# EAGLE design dosimeter (EAGLE 6.1)
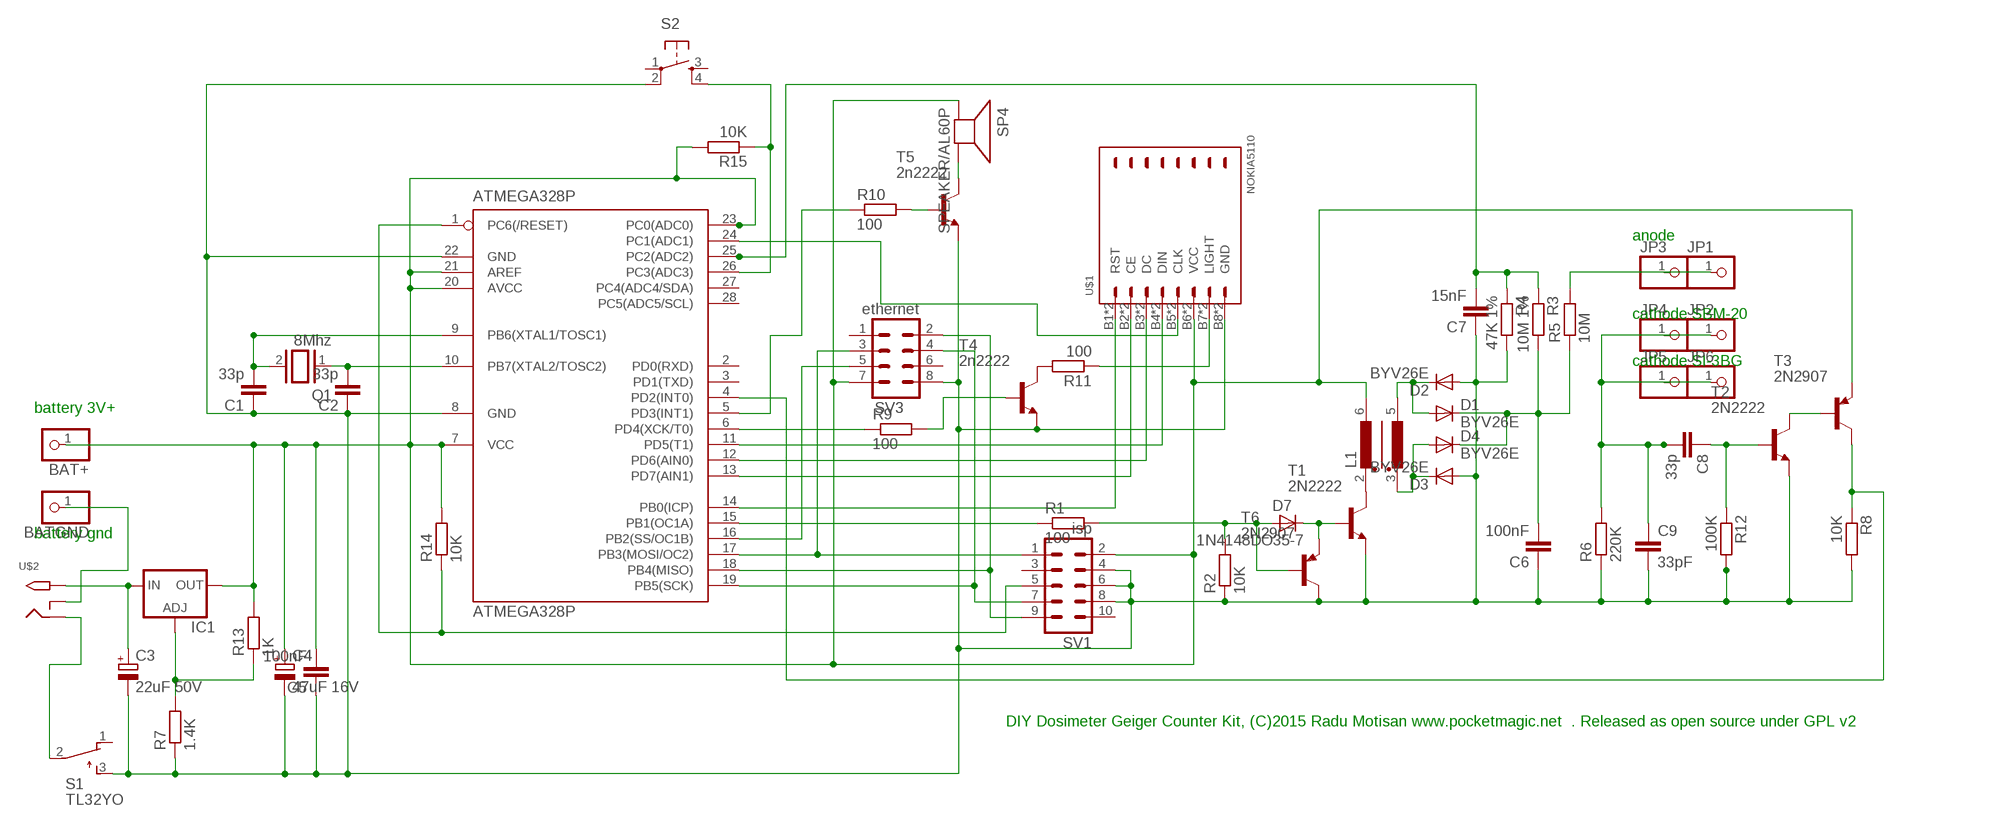
[diagram p0: schematic, sheet 1]

## Parts
ATMEGA328P  ATMEGA328P  MEGA8-P  [DIL28-3]
BAT+  PINHD-1X1  [1X01]
BATGND  PINHD-1X1  [1X01]
C1  33p  C2.5/2  [C2.5-2]
C2  33p  C2.5/2  [C2.5-2]
C3  22uF 50V  CPOL-EUE2-5  [E2-5]
C4  47uF 16V  CPOL-EUE2-5  [E2-5]
C5  100nF  C2.5/2  [C2.5-2]
C6  100nF  C5/3  [C5B3]
C7  15nF  C2.5/2  [C2.5-2]
C8  33p  C2.5/2  [C2.5-2]
C9  33pF  C2.5/2  [C2.5-2]
D1  BYV26E  1N40047.5  [D-7.5]
D2  BYV26E  1N40047.5  [D-7.5]
D3  BYV26E  1N40047.5  [D-7.5]
D4  BYV26E  1N40047.5  [D-7.5]
D7  1N4148DO35-7  [DO35-7]
IC1  LM317TL  [317TL]
JP1  PINHD-1X1  [1X01]
JP2  PINHD-1X1  [1X01]
JP3  PINHD-1X1  [1X01]
JP4  PINHD-1X1  [1X01]
JP5  PINHD-1X1  [1X01]
JP6  PINHD-1X1  [1X01]
L1  RM6-2  [RM5-4]
Q1  8Mhz  XTAL/S  [QS]
R1  100  R-EU_0204/7  [0204/7]
R2  10K  R-EU_0204/7  [0204/7]
R3  10M 1%  R-EU_0204/7  [0204/7]
R4  47K 1%  R-EU_0204/7  [0204/7]
R5  10M  R-EU_0204/7  [0204/7]
R6  220K  R-EU_0204/7  [0204/7]
R7  1.4K  R-EU_0204/7  [0204/7]
R8  10K  R-EU_0204/7  [0204/7]
R9  100  R-EU_0204/7  [0204/7]
R10  100  R-EU_0204/7  [0204/7]
R11  100  R-EU_0204/7  [0204/7]
R12  100K  R-EU_0204/7  [0204/7]
R13  1K  R-EU_0204/7  [0204/7]
R14  10K  R-EU_0204/7  [0204/7]
R15  10K  R-EU_0204/7  [0204/7]
S1  TL32YO  [TL3XYO]
S2  TAC_SWITCHPTH  [TACTILE-PTH]
SP4  SPEAKER/AL60P  [AL60P]
SV1  isp  MA05-2  [MA05-2]
SV3  ethernet  MA04-2  [MA04-2]
T1  2N2222  [TO92-EBC-OVAL]
T2  2N2222  [TO92-EBC-OVAL]
T3  2N2907  [TO92-EBC-OVAL]
T4  2n2222  2N2222-NPN-TO92-EBC  [TO92-EBC]
T5  2n2222  2N2222-NPN-TO92-EBC  [TO92-EBC]
T6  2N2907  [TO92-EBC-OVAL]
U$1  NOKIA5110  [NOKIA5110]
U$2  2.1MMJACKTHM  [PJ-102A]

## Nets
N$1: ATMEGA328P.9(PB6(XTAL1/TOSC1)) C1.2 Q1.2
N$2: ATMEGA328P.10(PB7(XTAL2/TOSC2)) C2.2 Q1.1
N$3: R11.2 T4.C
N$4: ATMEGA328P.17(PB3(MOSI/OC2)) SV1.1 SV3.3
N$5: ATMEGA328P.16(PB2(SS/OC1B)) SV3.5
N$6: ATMEGA328P.18(PB4(MISO)) SV1.9 SV3.2
N$7: R9.2 T4.B
N$8: ATMEGA328P.19(PB5(SCK)) SV1.7 SV3.4
N$9: R11.1 U$1.B7(LIGHT) U$1.T7(LIGHT)
N$11: ATMEGA328P.1(PC6(/RESET)) R14.1 SV1.5
N$12: ATMEGA328P.8(GND) ATMEGA328P.22(GND) C1.1 C2.1 C3.- C4.- C5.1 C6.1 C7.1 C9.2 D2.A D3.A R2.1 R4.2 R6.1 R7.1 R8.2 R12.2 S1.3(S) S2.2 SV1.4 SV1.6 SV1.8 SV3.8 T1.E T2.E T4.E T5.E T6.C U$1.B8(GND) U$1.T8(GND)
N$13: ATMEGA328P.24(PC1(ADC1)) U$1.B5(CLK) U$1.T5(CLK)
N$14: ATMEGA328P.26(PC3(ADC3)) R15.1 S2.4
N$15: S1.2(P) U$2.RING
N$18: JP1.1 JP3.1 R5.2
N$20: BATGND.1 U$2.RING_SW
N$21: ATMEGA328P.11(PD5(T1)) U$1.B4(DIN) U$1.T4(DIN)
N$22: ATMEGA328P.12(PD6(AIN0)) U$1.B3(DC) U$1.T3(DC)
N$23: ATMEGA328P.13(PD7(AIN1)) U$1.B2(CE) U$1.T2(CE)
N$24: ATMEGA328P.14(PB0(ICP)) U$1.B1(RST) U$1.T1(RST)
N$25: ATMEGA328P.7(VCC) ATMEGA328P.20(AVCC) ATMEGA328P.21(AREF) ATMEGA328P.23(PC0(ADC0)) BAT+.1 C4.+ C5.2 IC1.2(OUT) L1.6(W1E) R13.2 R14.2 R15.2 SP4.1(+) SV1.2 SV3.7 T3.E U$1.B6(VCC) U$1.T6(VCC)
N$26: ATMEGA328P.15(PB1(OC1A)) R1.1
N$27: D7.A R1.2 R2.2 T6.B
N$28: C3.+ IC1.3(IN) U$2.TIP
N$31: L1.2(W1A) T1.C
N$32: D3.C D4.A L1.3(W2A)
N$33: D1.A D2.C L1.5(W2E)
N$34: ATMEGA328P.6(PD4(XCK/T0)) R9.1
N$35: C6.2 D1.C D4.C R3.2 R5.1
N$40: SP4.2(-) T5.C
N$41: R10.2 T5.B
N$42: ATMEGA328P.5(PD3(INT1)) R10.1
N$48: IC1.1(ADJ) R7.2 R13.1
N$52: C8.2 C9.1 JP2.1 JP4.1 JP5.1 JP6.1 R6.2
N$54: ATMEGA328P.25(PC2(ADC2)) C7.2 R3.1 R4.1
N$56: C8.1 R12.1 T2.B
N$59: T2.C T3.B
N$60: ATMEGA328P.4(PD2(INT0)) R8.1 T3.C
N$74: D7.C T1.B T6.E
Unconnected: ATMEGA328P.2(PD0(RXD)) ATMEGA328P.3(PD1(TXD)) ATMEGA328P.27(PC4(ADC4/SDA)) ATMEGA328P.28(PC5(ADC5/SCL)) S1.1(O) S2.1 S2.3 SV1.3 SV1.10 SV3.1 SV3.6

## Notes on the sheet
- anode
- cathode SBM-20
- cathode SI-3BG
- battery 3V+
- battery gnd
- DIY Dosimeter Geiger Counter Kit, (C)2015 Radu Motisan www.pocketmagic.net  . Released as open source under GPL v2

## Library data of the parts
ATMEGA328P = atmel:MEGA8-P: MICROCONTROLLER 8 Kbytes FLASH, 1 kbytes SRAM, 512 bytes EEPROM, USART, 4-channel 10 bit ADC, 2-channel 8 bit ADC Pin compatible with Atmega48, ATMega88, ATMega168 Source: avr.lbr; OC_FARNELL: unknown; OC_NEWARK: unknown
BAT+ BATGND JP1-JP6 = adafruit:PINHD-1X1: Pin header 1x1 for 0.1" spacing With round pins
C1 C2 C5-C9 = capacitor-wima:C: CAPACITOR naming: grid - package width
C3 C4 = resistor:CPOL-EU: POLARIZED CAPACITOR, European symbol
D1-D4 = diode:1N4004: DIODE general purpose rectifier, 1 A
D7 = Diode2:1N4148: DIODE high speed (Philips)
IC1 = v-reg:LM317TL: VOLTAGE REGULATOR
L1 = trafo-siemens:RM6-2: TRANSFORMER; OC_FARNELL: unknown; OC_NEWARK: unknown
Q1 = special:XTAL/S: CRYSTAL
R1-R15 = rcl:R-EU_: RESISTOR, European symbol
S1 = switch:TL32YO: TINY SWITCH ON - MOM Source: http://www2.produktinfo.conrad.com/datenblaetter/700000-724999/705152-da-01-de-Subminiaturschalter_TL_36YO.pdf
S2 = sparkfun-electromechanical:TAC_SWITCH: Momentary Switch Button commonly used for reset or general input. Spark Fun Electronics SKU : COM-00097 SMT- SWCH-08247
SP4 = adafruit:SPEAKER: SPEAKER Source: Buerklin Added PS12 (for part # PS1240 piezo) http://www.ladyada.net/library/pcb/eaglelibrary.html
SV1 = con-lstb:MA05-2: PIN HEADER; OC_FARNELL: unknown; OC_NEWARK: unknown
SV3 = con-lstb:MA04-2: PIN HEADER; OC_FARNELL: unknown; OC_NEWARK: unknown
T1 T2 = adafruit:2N2222: NPN TRANSISTOR Big oval pads
T3 T6 = adafruit:2N2907*: PNP Transistor Big Oval pads
T4 T5 = transistor-neu-to92:*-NPN-: NPN Transistror
U$1 = NOKIA5110_OK:NOKIA5110
U$2 = adafruit:2.1MMJACK: 2.1mm x 5.5mm THM DC jack with internal switch. Digikey part #PJ-102A, 4UCON part #05537 2.1mm x 5.5mm SMT DC jack with internal switch. Digikey part #PJ-002A-SMT, 4UCON part #03267 By microbuilder.eu & adafruit.com

## Board
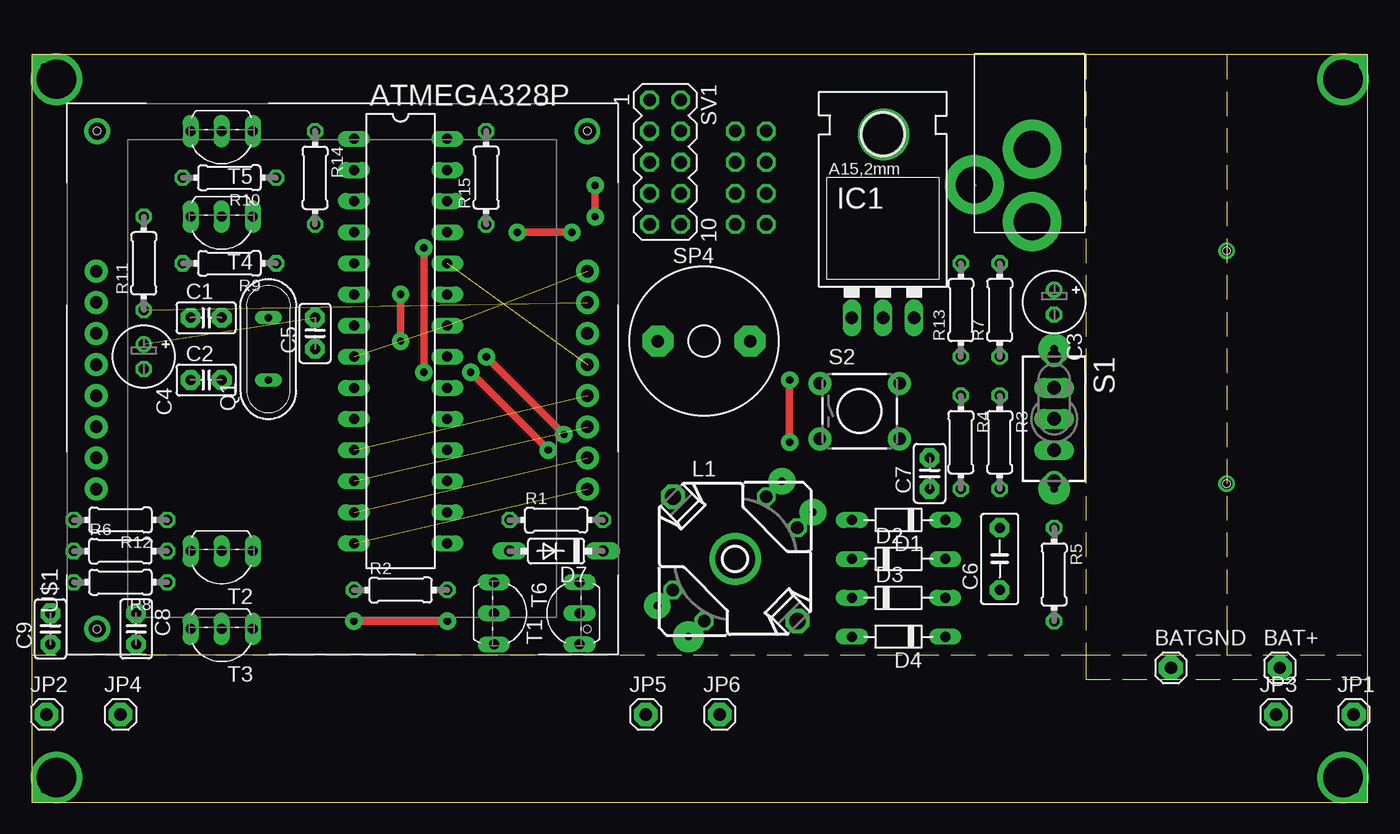
[diagram p1: board, top side]
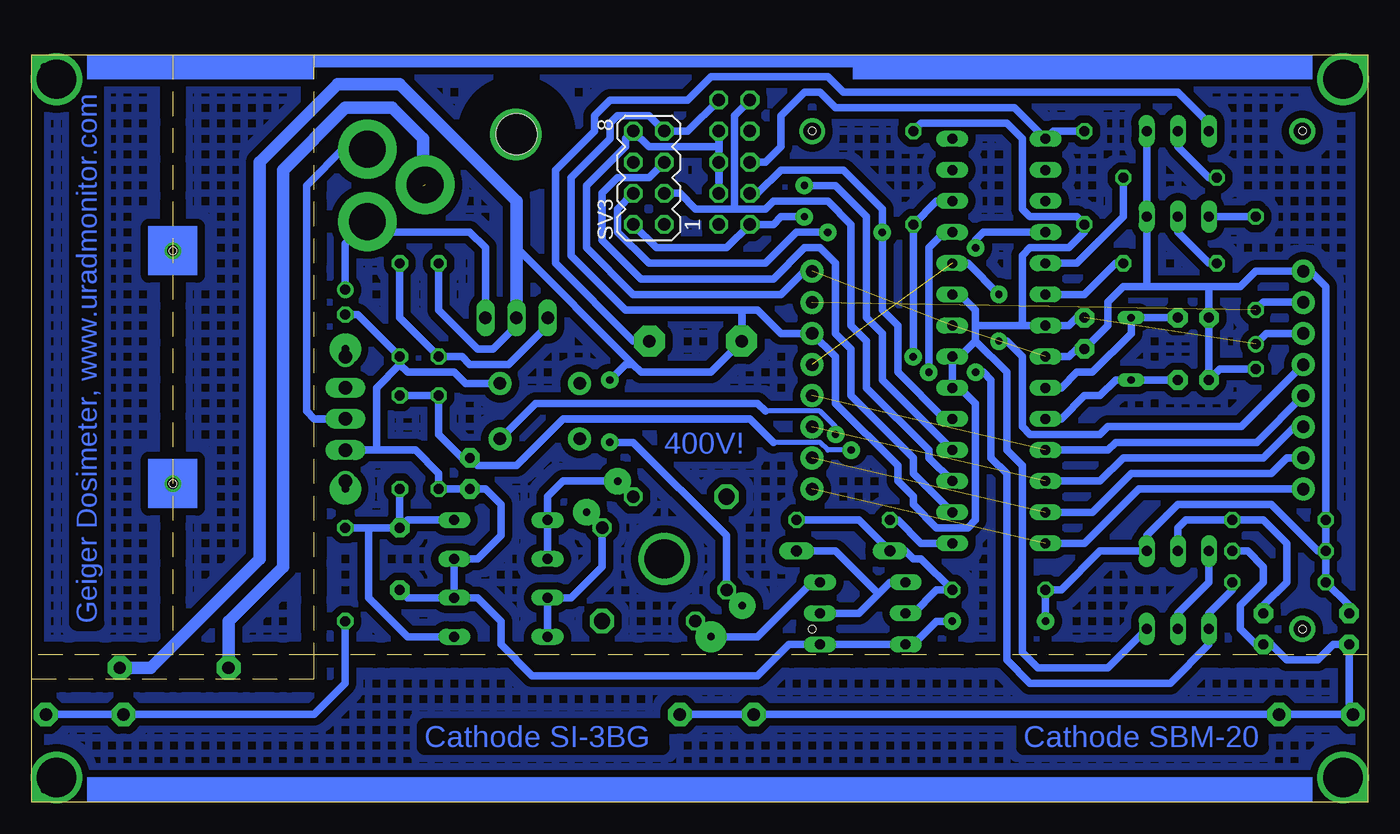
[diagram p2: board, bottom side, seen from below]

Size 109 x 61 mm. Coordinates in mm from the lower left corner, seen from the top.
Outline: 109,10 109,0 0,0 0,12
Outline: 109,10 109,12
Outline: 109,12 109,61 97.5,61
Outline: 97.5,61 86,61
Outline: 86,61 0,61 0,12
Outline: 0,12 86,12
Outline: 86,12 97.5,12
Outline: 97.5,12 109,12
Outline: 86,61 86,12
Outline: 97.5,61 97.5,12
Outline: 86,12 86,10 109,10
Outline: 109,10 109,12
Copper layers (1*16): Top 0.035mm / dielectric 1.5mm / Bottom 0.035mm
Design rules: minimum track width 10mil, minimum drill 24mil, track to track 8mil, track to pad 8mil, pad to pad 8mil, via to via 8mil, smd to smd 8mil, copper to edge 40mil, drill to drill 8mil, minimum pad ring 10mil, minimum via ring 8mil, stop-mask expansion 4mil, vias tented up to drill 0mil, thermal gap 10mil
Holes 0.6 mm at 97.5,45 97.5,26

### Footprints (pad centres in the part's own frame; a part is rotated, then mirrored left to right if it is on the bottom)
DIL28-3 = drill 0.813 long: 1 -16.51,-3.81; 2 -13.97,-3.81; 3 -11.43,-3.81; 4 -8.89,-3.81; 5 -6.35,-3.81; 6 -3.81,-3.81; 7 -1.27,-3.81; 8 1.27,-3.81; 9 3.81,-3.81; 10 6.35,-3.81; 11 8.89,-3.81; 12 11.43,-3.81; 13 13.97,-3.81; 14 16.51,-3.81; 15 16.51,3.81; 16 13.97,3.81; 17 11.43,3.81; 18 8.89,3.81; 19 6.35,3.81; 20 3.81,3.81; 21 1.27,3.81; 22 -1.27,3.81; 23 -3.81,3.81; 24 -6.35,3.81; 25 -8.89,3.81; 26 -11.43,3.81; 27 -13.97,3.81; 28 -16.51,3.81
1X01 = drill 1.016 pad 1.93 octagon: 1 0,0
C2.5-2 = drill 0.813 pad 1.6 octagon: 1 -1.27,0; 2 1.27,0
E2-5 = drill 0.813 pad 1.27: + -1.016,0 | drill 0.813 pad 1.27 octagon: - 1.016,0
C5B3 = drill 0.813 pad 1.6 octagon: 1 -2.54,0; 2 2.54,0
D-7.5 = drill 0.813 long: A 3.81,0; C -3.81,0
DO35-7 = drill 0.9 long: A 3.81,0; C -3.81,0
317TL = drill 1.016 long: 1 -2.54,-3.81; 2 0,-3.81; 3 2.54,-3.81 | hole 3.302: 0,11.176
RM5-4 = drill 1.016 octagon: 2 5.08,-2.54; 3 -2.54,5.08; 5 -5.08,2.54; 6 2.54,-5.08 | drill 1.321 octagon: M -5.08,-5.08; M1 5.08,5.08
QS = drill 0.61 long: 1 -2.54,0; 2 2.54,0
0204/7 = drill 0.813 octagon: 1 -3.81,0; 2 3.81,0
TL3XYO = drill 1.1 pad 1.422 long: 1 -2.54,0; 2 0,0; 3 2.54,0 | drill 1.1 pad 1.676: M1 -5.08,0; M2 5.08,0
TACTILE-PTH = drill 1.016 pad 1.88: 1 -3.251,2.261; 2 3.251,2.261; 3 -3.251,-2.261; 4 3.251,-2.261
AL60P = drill 1.016 pad 2.54 octagon: 1 -3.759,0; 2 3.759,0
MA05-2 = drill 1.016 octagon: 1 -5.08,-1.27; 2 -5.08,1.27; 3 -2.54,-1.27; 4 -2.54,1.27; 5 0,-1.27; 6 0,1.27; 7 2.54,-1.27; 8 2.54,1.27; 9 5.08,-1.27; 10 5.08,1.27
MA04-2 = drill 1.016 octagon: 1 -3.81,-1.27; 2 -3.81,1.27; 3 -1.27,-1.27; 4 -1.27,1.27; 5 1.27,-1.27; 6 1.27,1.27; 7 3.81,-1.27; 8 3.81,1.27
TO92-EBC-OVAL = drill 0.813 long: B 0,-1.27; C 2.54,-1.27; E -2.54,-1.27
TO92-EBC = drill 0.813 long: B 0,-1.27; C 2.54,-1.27; E -2.54,-1.27
NOKIA5110 = drill 1.016 pad 1.88: B1 -0.01,0; B2 2.53,0; B3 5.07,0; B4 7.61,0; B5 10.15,0; B6 12.69,0; B7 15.23,0; B8 17.77,0; T1 -0.01,40.08; T2 2.53,40.08; T3 5.07,40.08; T4 7.61,40.08; T5 10.15,40.08; T6 12.69,40.08; T7 15.23,40.08; T8 17.77,40.08 | hole 0.6: -11.43,0; 29.21,0; -11.43,40.005; 29.21,40.005
PJ-102A = drill 3 pad 4.8: RING 0.1,-3.39; RING_SW -4.6,-6.29; TIP 0.1,-9.29

### Placement (x,y rotation side)
ATMEGA328P  30.09,37.62 270 top
BAT+  101.84,10.95 0 top
BATGND  92.95,10.95 0 top
C1  14.21,39.53 0 top
C2  14.21,34.45 0 top
C3  83.42,40.8 270 top
C4  9.13,36.35 270 top
C5  23.1,38.26 90 top
C6  78.98,19.84 90 top
C7  73.27,26.83 90 top
C8  8.5,14.13 270 top
C9  1.51,14.13 90 top
D1  70.72,23.02 180 top
D2  70.72,19.84 0 top
D3  70.72,16.67 0 top
D4  70.72,13.5 180 top
D7  42.78,20.48 180 top
IC1  69.45,43.34 0 top
JP1  107.87,7.14 0 top
JP2  1.19,7.14 0 top
JP3  101.52,7.14 0 top
JP4  7.23,7.14 0 top
JP5  50.09,7.14 0 top
JP6  56.12,7.14 0 top
L1  57.39,19.84 270 top
Q1  19.29,36.99 90 top
R1  42.78,23.02 0 top
R2  30.09,17.3 0 top
R3  78.98,29.37 270 top
R4  75.81,29.37 270 top
R5  83.42,18.57 270 top
R6  7.23,20.48 0 top
R7  78.98,40.16 90 top
R8  7.23,17.94 180 top
R9  16.11,43.98 180 top
R10  16.11,50.96 180 top
R11  9.13,43.98 90 top
R12  7.23,23.02 180 top
R13  75.81,40.16 90 top
R14  23.1,50.96 270 top
R15  37.07,50.96 90 top
S1  83.42,31.27 270 top
S2  67.55,31.91 0 top
SP4  54.85,37.62 0 top
SV1  51.67,52.23 270 top
SV3  58.66,50.96 90 bottom
T1  43.42,15.4 90 top
T2  15.48,19.21 180 top
T3  15.48,12.86 180 top
T4  15.48,46.52 180 top
T5  15.48,53.5 180 top
T6  38.98,15.4 270 top
U$1  45.33,25.56 90 top
U$2  81.52,56.67 0 top

### Tracks (layer width: path | path; a pad name or v marks a point on that pad's centre or on a via)
N$1
  Bottom 0.61: C1.2 Q1.2 19.29,38.26 22.47,35.09 23.73,35.09 25.01,33.81 ATMEGA328P.9
N$2
  Bottom 0.61: C2.2 Q1.1 20.56,34.45 21.83,33.18 23.1,33.18 25.01,31.27 ATMEGA328P.10
N$3
  Bottom 0.61: T4.C R11.2
N$4
  Bottom 0.61: SV1.1 51.67,56.04 51.67,48.42 | 51.67,48.42 54.85,48.42 56.12,49.69 SV3.3 | ATMEGA328P.17 35.8,28.1 35.8,28.73 40.88,33.81 40.88,37.62 42.15,38.9 42.15,47.15 44.05,49.05 48.5,49.05 49.14,48.42 51.67,48.42
N$5
  Bottom 0.61: SV3.5 58.66,50.96 61.2,50.96 62.47,49.69 62.47,45.88 59.3,42.7 48.5,42.7 45.96,45.24 44.69,45.24 43.42,43.98 43.42,38.26 42.15,36.99 42.15,33.18 37.07,28.1 37.07,26.83 ATMEGA328P.16 34.53,23.66
N$6  (via drill 0.6 pad 1.42)
  Top 0.61: v45.96,50.33 v45.96,47.78
  Bottom 0.61: SV3.2 58.03,45.24 52.31,45.24 SV1.9 48.5,47.15 47.87,47.78 v45.96,47.78 | 34.53,28.73 ATMEGA328P.18 39.61,34.45 39.61,38.26 40.88,39.53 40.88,47.78 43.42,50.33 v45.96,50.33
N$7
  Bottom 0.61: R9.2 12.94,43.98 15.48,46.52 T4.B
N$8  (via drill 0.6 pad 1.42)
  Top 0.61: v44.05,46.52 v39.61,46.52
  Bottom 0.61: SV3.4 61.2,48.42 61.2,46.52 58.66,43.98 49.14,43.98 46.59,46.52 v44.05,46.52 | ATMEGA328P.19 34.53,31.27 38.34,35.09 38.34,38.9 39.61,40.16 v39.61,46.52 39.61,48.42 42.78,51.59 47.87,51.59 49.77,49.69 SV1.7
N$9  (1 unrouted)
  Bottom 0.61: R11.1 8.5,40.8 U$1.T7
N$10  (via drill 0.9 pad 0.3)
  other vias: 97.5,45
N$11
  Bottom 0.61: SV1.5 49.14,52.23 47.87,53.5 47.87,56.04 45.96,57.94 44.69,57.94 43.42,56.67 28.81,56.67 ATMEGA328P.1 25.64,54.77 R14.1
N$12  (via drill 0.6 pad 1.42)  (2 unrouted)
  Top 0.61: v26.27,14.77 v33.9,14.77
  Bottom 0.61: D3.A D2.A 72.63,19.84 70.72,21.75 70.72,24.29 72,25.56 C7.1 R4.2 75.81,26.83 77.71,28.73 80.89,28.73 | ATMEGA328P.8 24.37,36.35 23.73,36.99 C5.1 21.2,38.9 21.2,40.8 19.92,42.07 18.02,42.07 | T5.E T4.E 18.02,42.07 | 12.94,42.07 C1.1 C2.1 12.05,35.34 C4.- | 18.02,42.07 12.94,42.07 | SV1.4 52.94,53.5 | 52.94,53.5 SV1.6 SV1.8 | 52.94,53.5 58.66,53.5 SV3.8 60.56,54.14 60.56,53.5 63.74,50.33 63.74,45.24 59.93,41.44 47.87,41.44 45.97,43.33 U$1.B8 | 12.94,42.07 10.4,42.07 9.13,43.34 U$1.T8 5.23,43.34 4.68,43.34 3.41,42.07 R6.1 | C9.2 1.51,16.04 R8.2 R6.1 | R6.1 R12.2 | R6.1 4.05,20.48 7.86,24.29 15.48,24.29 18.02,21.75 T2.E 21.83,20.48 25.01,17.3 R2.1 v26.27,14.77 | C6.1 78.34,16.67 D3.A | D3.A 72.63,16.67 70.72,14.77 70.72,12.86 68.19,10.32 49.77,10.32 47.23,12.86 T1.E T6.C 37.07,12.86 35.16,14.77 v33.9,14.77 | S1.3 80.89,28.73 | C3.- 82.41,39.78 R7.1 78.98,35.72 | 78.98,35.72 80.89,33.81 80.89,28.73 | S2.2 73.62,34.17 74.53,35.09 78.34,35.09 78.98,35.72
N$13  (via drill 0.6 pad 1.42)  (1 unrouted)
  Top 0.61: v30.09,41.44 v30.09,37.62
  Bottom 0.61: v30.09,37.62 29.45,37.62 28.18,36.35 28.18,30.64 27.55,30.01 21.83,30.01 21.2,30.64 10.32,30.64 U$1.T5 | v30.09,41.44 32.62,43.98 ATMEGA328P.24
N$14  (via drill 0.6 pad 1.42)
  Top 0.61: v37.07,36.35 v43.42,30.01
  Bottom 0.406: v43.42,30.01 43.42,30.64 44.69,31.91 49.14,31.91
  Bottom 0.61: ATMEGA328P.26 35.16,49.05 R15.1 v37.07,36.35 | 49.14,31.91 49.77,32.55 67.91,32.55 S2.4
N$15
  Bottom 0.61: S1.2 85.97,31.27 86.6,31.91 86.6,50.33 83.42,53.5 81.83,53.5 U$2.RING
N$16  (via drill 0.9 pad 0.3)
  other vias: 97.5,26
N$17  (via drill 0.6 pad 2.54)
  other vias: 83.42,36.99
N$18
  Bottom 0.61: JP1.1 JP3.1 85.97,7.14 83.42,9.68 R5.2
N$19  (via drill 1.4)
  other vias: 5.32,14.13
N$20  (1 unrouted)
  Bottom 1.016: BATGND.1 92.95,14.77 88.5,19.21 88.5,51.59 83.42,56.67 79.61,56.67 77.08,54.14 77.08,50.33
N$21  (1 unrouted)
  Bottom 0.61: ATMEGA328P.11 21.2,28.73 20.56,29.37 9.05,29.37 U$1.T4
N$22  (1 unrouted)
  Bottom 0.61: ATMEGA328P.12 21.83,26.2 19.92,28.1 8.5,28.1 5.95,30.64 U$1.T3
N$23  (1 unrouted)
  Bottom 0.61: ATMEGA328P.13 22.47,23.66 19.29,26.83 7.86,26.83 6.59,28.1 U$1.T2
N$24  (1 unrouted)
  Bottom 0.61: ATMEGA328P.14 23.1,21.11 18.66,25.56 U$1.T1
N$25  (via drill 0.6 pad 1.42)  (1 unrouted)
  Top 0.61: v61.83,29.37 v61.83,34.45
  Bottom 0.61: C5.2 23.73,39.53 24.37,38.9 ATMEGA328P.7 28.18,38.9 | ATMEGA328P.23 33.26,41.44 31.99,40.16 31.99,38.9 | 28.18,38.9 31.99,38.9 | 31.99,38.9 31.99,37.62 | 31.99,37.62 33.26,36.35 ATMEGA328P.21 ATMEGA328P.20 33.26,33.81 31.99,32.55 31.99,23.02 32.62,22.38 35.16,22.38 37.07,24.29 37.07,24.92 38.34,26.2 38.34,27.47 43.42,32.55 43.42,36.35 U$1.B6 47.85,38.25 49.77,40.16 51.04,40.16 | SV1.2 55.48,54.77 SV3.7 58.66,56.04 61.2,56.04 61.83,55.41 61.83,54.14 65.01,50.96 65.01,44.61 60.56,40.16 51.04,40.16 | 31.99,37.62 29.45,35.09 29.45,28.73 28.18,27.47 28.18,12.23 26.91,10.95 21.2,10.95 T3.E | R13.2 75.81,40.16 72.63,36.99 71.36,36.99 69.45,38.9 IC1.2 | U$1.T6 8.25,38.25 C4.+ | 69.45,45.24 59.93,35.72 | 28.18,38.9 28.18,44.61 27.55,45.24 24.37,45.24 23.1,46.52 R14.2 23.73,47.78 27.55,47.78 28.18,48.42 28.18,54.14 29.45,55.41 36.44,55.41 R15.2 | 51.04,37.62 53.58,35.09 59.3,35.09 59.93,35.72 | 51.04,37.62 51.04,40.16 | 51.04,37.62 SP4.1 | 51.04,16.04 L1.6 52.31,21.75 59.93,29.37 v61.83,29.37 | v61.83,34.45 60.56,35.72 59.93,35.72
  Bottom 1.016: BAT+.1 99.3,10.95 90.41,19.84 90.41,52.23 84.06,58.58 78.98,58.58 69.45,49.05 69.45,45.24 IC1.2
N$26
  Bottom 0.61: ATMEGA328P.15 36.44,21.11 38.34,23.02 R1.1
N$27
  Bottom 0.61: R1.2 41.52,23.02 D7.A 37.7,20.48 37.07,19.84 36.44,19.84 R2.2 35.16,17.3 37.07,15.4 T6.B
N$28
  Bottom 0.61: IC1.3 72,45.24 73.27,46.52 80.75,46.52 U$2.TIP 83.42,45.58 C3.+
N$29  (via drill 0.6 pad 2)
  other vias: 108,1
N$30  (via drill 0.6 pad 2)
  other vias: 108,60
N$31
  Bottom 0.61: T1.C 45.33,17.94 49.77,13.5 53.58,13.5 L1.2
N$32
  Bottom 0.61: 63.74,23.66 L1.3 62.47,19.21 65.01,16.67 D3.C D4.A
N$33
  Bottom 0.61: L1.5 61.2,26.2 65.64,26.2 66.92,24.92 D1.A D2.C
N$34
  Bottom 0.61: ATMEGA328P.6 23.1,41.44 20.56,43.98 R9.1
N$35
  Bottom 0.61: D1.C 78.34,23.02 C6.2 | C6.2 81.52,22.38 | 81.52,22.38 R5.1 | D4.C 78.34,13.5 81.52,16.67 81.52,22.38 | R3.2 C6.2
N$36  (via drill 0.6 pad 2.18)
  other vias: 51.04,16.04
N$37  (via drill 0.6 pad 2.54)
  other vias: 53.58,13.5
N$38  (via drill 0.6 pad 2.18)
  other vias: 61.2,26.2
N$39  (via drill 0.6 pad 2.18)
  other vias: 63.74,23.66
N$40
  Bottom 0.61: T5.C 12.94,55.41 15.48,57.94 42.78,57.94 44.05,59.22 53.58,59.22 55.48,57.31 61.83,57.31 63.11,56.04 63.11,54.77 66.28,51.59 66.28,43.98 59.93,37.62 SP4.2
N$41
  Bottom 0.61: R10.2 12.94,50.96 15.48,53.5 T5.B
N$42
  Bottom 0.61: ATMEGA328P.5 23.73,43.98 19.92,47.78 R10.1
N$43  (via drill 0.6 pad 1.42)
  other vias: 76.97,50.43
N$44  (via drill 1.4)
  other vias: 5.32,54.77
N$45  (via drill 1.4)
  other vias: 45.33,54.77
N$46  (via drill 0.6 pad 2)
  other vias: 1,1
N$47  (via drill 0.6 pad 2)
  other vias: 1,60
N$48
  Bottom 0.61: R7.2 78.98,39.53 R13.1 73.9,36.35 73.27,35.72 70.09,35.72 66.92,38.9 IC1.1
N$49  (via drill 0.6 pad 2.54)
  other vias: 83.42,25.56
N$50  (via drill 0.6 pad 1.42)
  other vias: 50.41,57.31
N$51  (via drill 0.6 pad 1.42)
  other vias: 52.94,57.31
N$52
  Bottom 0.61: JP4.1 JP2.1 | R6.2 9.77,20.48 8.5,19.21 8.5,17.94 10.4,16.04 10.4,14.13 9.13,12.86 C8.2 7.86,12.86 6.59,11.59 4.05,11.59 2.78,12.86 C9.1 1.51,7.46 JP2.1 | JP2.1 JP5.1 JP6.1
N$53  (via drill 0.6 pad 1.42)
  other vias: 50.41,54.77
N$54  (via drill 0.6 pad 1.42)
  Top 0.61: v35.8,35.09 v42.15,28.73
  Bottom 0.406: v42.15,28.73 44.05,28.73 44.69,29.37 48.5,29.37
  Bottom 0.61: R3.1 R4.1 75.81,30.01 73.9,28.1 C7.2 72.63,27.47 69.45,27.47 65.64,31.27 50.41,31.27 48.5,29.37 | ATMEGA328P.25 34.53,46.52 35.8,45.24 v35.8,35.09
N$55  (via drill 0.6 pad 1.42)
  other vias: 52.94,54.77
N$56
  Bottom 0.61: C8.1 8.5,16.04 6.59,17.94 6.59,21.11 8.5,23.02 R12.1 14.84,23.02 15.48,22.38 T2.B
N$57  (via drill 0.6 pad 1.42)
  other vias: 50.41,52.23
N$58  (via drill 0.6 pad 1.42)
  other vias: 52.94,52.23
N$59
  Bottom 0.61: T2.C 12.94,17.94 15.48,15.4 T3.B
N$60  (via drill 0.6 pad 1.42)
  Top 0.61: v31.99,45.24 v31.99,35.09
  Bottom 0.61: R8.1 11.04,17.3 12.94,15.4 T3.C 12.94,12.86 16.11,9.68 27.55,9.68 29.45,11.59 29.45,26.83 30.72,28.1 30.72,34.45 31.35,35.09 v31.99,35.09 | ATMEGA328P.4 31.35,46.52 31.99,45.88 v31.99,45.24
N$61  (via drill 0.6 pad 1.42)
  other vias: 50.41,49.69
N$62  (via drill 0.6 pad 1.42)
  other vias: 52.94,49.69
N$63  (via drill 0.6 pad 1.42)
  other vias: 50.41,47.15
N$64  (via drill 0.6 pad 1.42)
  other vias: 52.94,47.15
N$65  (via drill 0.6 pad 1.42)
  other vias: 57.39,54.77
N$66  (via drill 0.6 pad 1.42)
  other vias: 59.93,54.77
N$67  (via drill 0.6 pad 1.42)
  other vias: 57.39,52.23
N$68  (via drill 0.6 pad 1.42)
  other vias: 59.93,52.23
N$69  (via drill 0.6 pad 1.42)
  other vias: 57.39,49.69
N$70  (via drill 0.6 pad 1.42)
  other vias: 59.93,49.69
N$71  (via drill 0.6 pad 1.42)
  other vias: 57.39,47.15
N$72  (via drill 0.6 pad 1.42)
  other vias: 59.93,47.15
N$73  (via drill 0.6 pad 2.54)
  other vias: 69.48,54.55
N$74
  Bottom 0.61: T6.E 38.98,17.94 39.93,16.99 | 39.93,16.99 41.52,15.4 T1.B | D7.C 43.42,20.48 39.93,16.99
N$75  (via drill 0.6 pad 1.42)
  other vias: 81.68,47.4
N$76  (via drill 0.6 pad 1.42)
  other vias: 81.68,53.35
N$77
  pour Bottom (isolate 0.61, hatched): 0,61 109,61 109,0 0,0
N$79  (via drill 3.2 pad 3.81)
  other vias: 57.39,19.84
N$80  (via drill 3.2 pad 3.81)
  other vias: 2,59
N$81  (via drill 3.2 pad 3.81)
  other vias: 2,2
N$82  (via drill 3.2 pad 3.81)
  other vias: 107,2
N$83  (via drill 3.2 pad 3.81)
  other vias: 107,59
N$84  (via drill 3.2 pad 3.81)
  other vias: 69.5,54.5
(copper drawn outside any net)
  shapes: Bottom area x6

### Text on the board
Bottom: 400V! | Geiger Dosimeter, www.uradmonitor.com | Cathode SBM-20 | Cathode SI-3BG